# Altium schematic sheet io_conn.SchDoc: CPU I/O and USB Connectors
size B; Engineer: Michael J. Kelly; Organization: CSB540otn - Outernet; Address1: AM335x Compute Board; Address2: (C) 2015; Address3: See us on the Web:; Address4: http://outernet.is; DocumentNumber: 7; Revision: V1.0; SheetNumber: 7; SheetTotal: 9
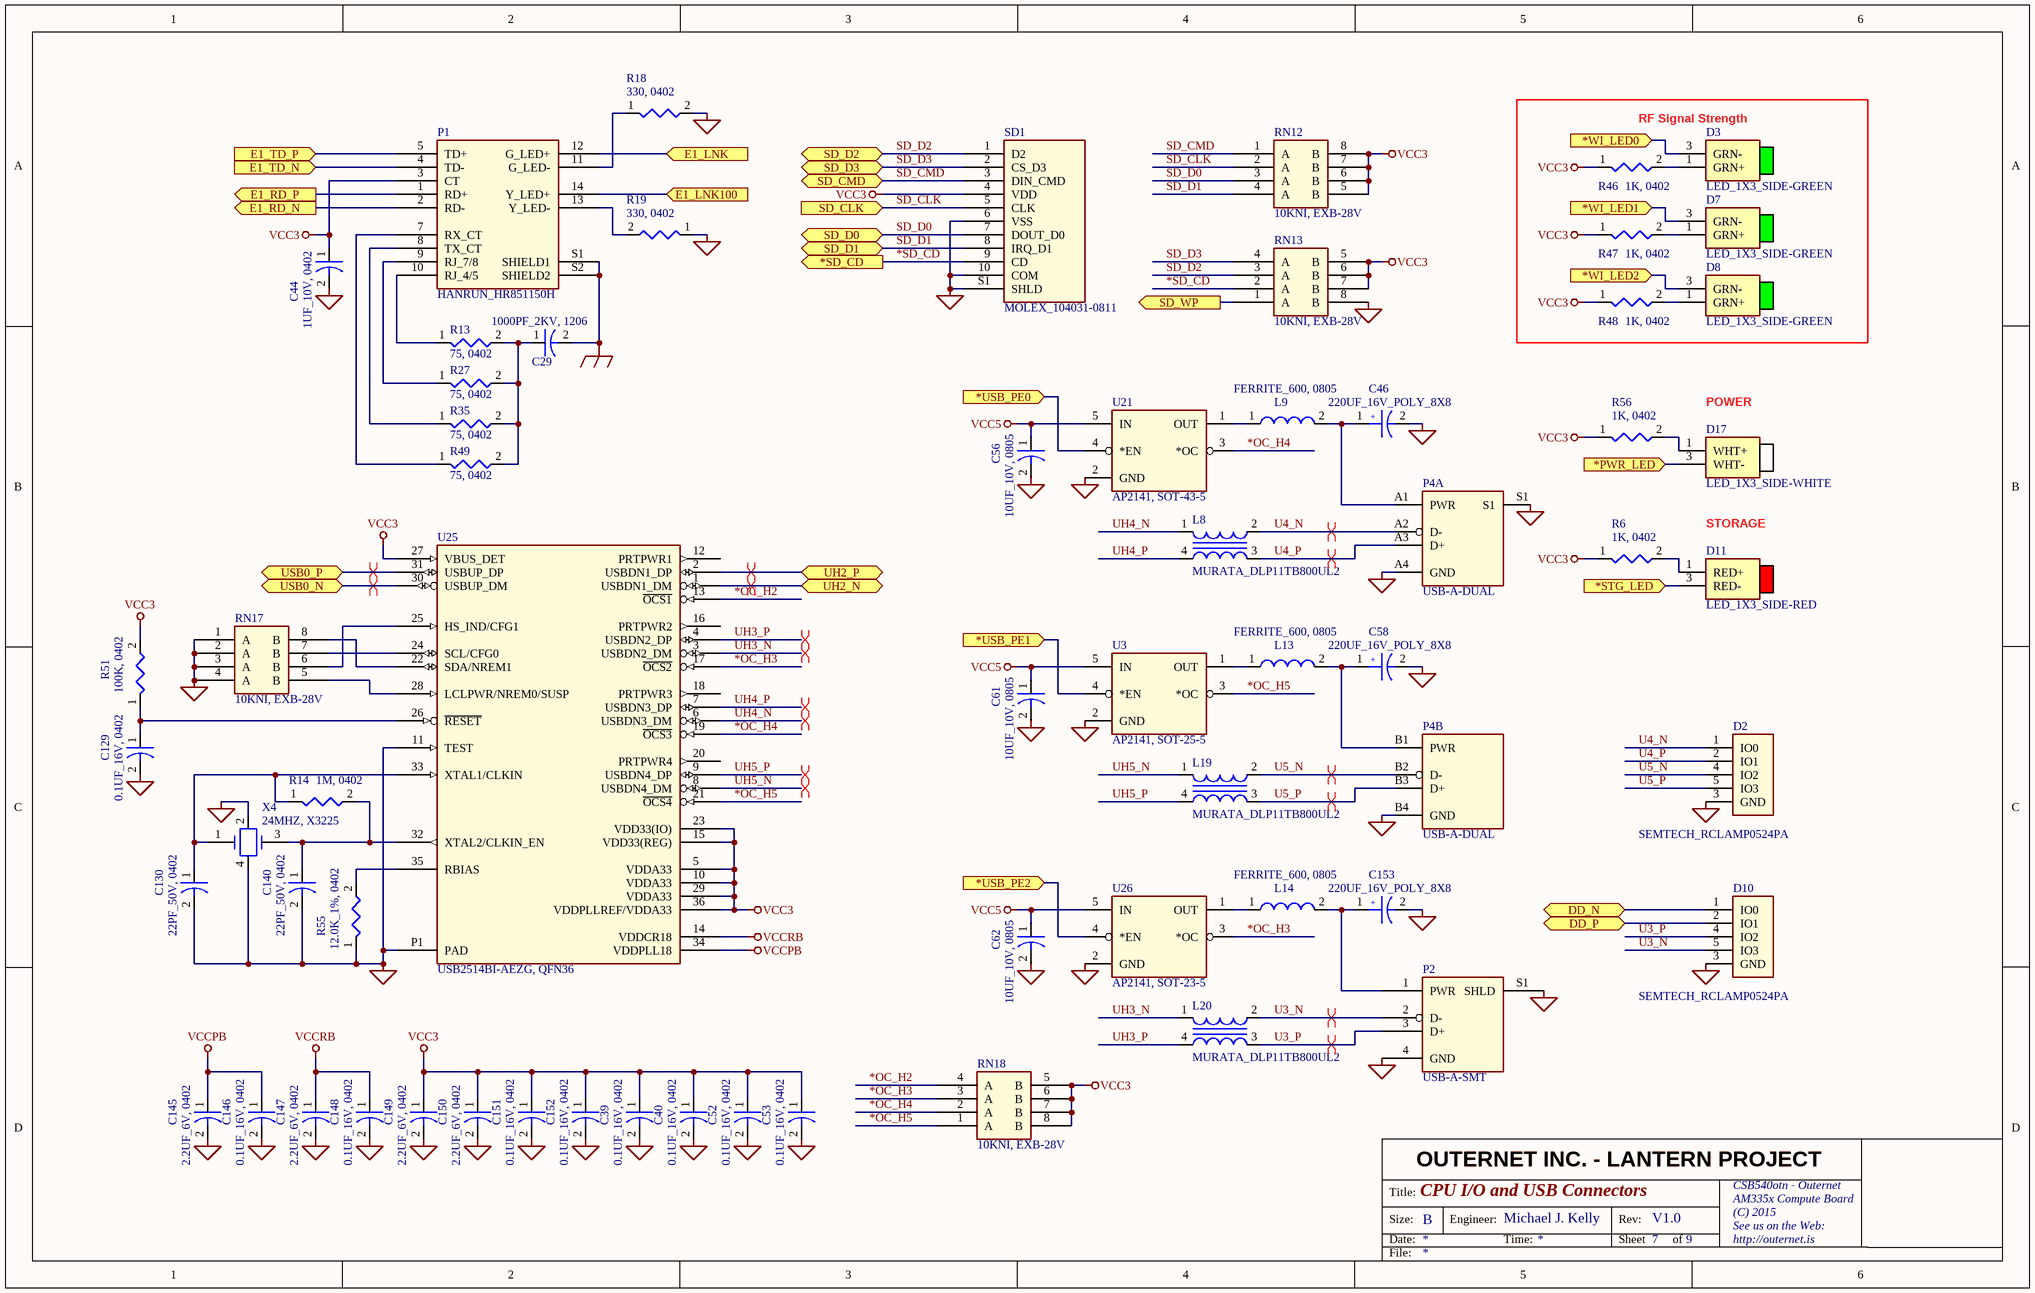
[diagram p0: io_conn.SchDoc]

## Parts
C29  1000PF_2KV, 1206  [1206C]
C39  0.1UF_16V, 0402  [0402C]
C40  0.1UF_16V, 0402  [0402C]
C44  1UF_10V, 0402  [0402C]
C46  220UF_16V_POLY_8X8  [ELEC_8MM_8MM]
C52  0.1UF_16V, 0402  [0402C]
C53  0.1UF_16V, 0402  [0402C]
C56  10UF_10V, 0805  [0805C]
C58  220UF_16V_POLY_8X8  [ELEC_8MM_8MM]
C61  10UF_10V, 0805  [0805C]
C62  10UF_10V, 0805  [0805C]
C129  0.1UF_16V, 0402  [0402C]
C130  22PF_50V, 0402  [0402C]
C140  22PF_50V, 0402  [0402C]
C145  2.2UF_6V, 0402  [0402C]
C146  0.1UF_16V, 0402  [0402C]
C147  2.2UF_6V, 0402  [0402C]
C148  0.1UF_16V, 0402  [0402C]
C149  2.2UF_6V, 0402  [0402C]
C150  2.2UF_6V, 0402  [0402C]
C151  0.1UF_16V, 0402  [0402C]
C152  0.1UF_16V, 0402  [0402C]
C153  220UF_16V_POLY_8X8  [ELEC_8MM_8MM]
D2  SEMTECH_RCLAMP0524PA  [RCLAMP0524]
D3  LED_1X3_SIDE-GREEN  [LED_1X3_SIDE-GREEN]
D7  LED_1X3_SIDE-GREEN  [LED_1X3_SIDE-GREEN]
D8  LED_1X3_SIDE-GREEN  [LED_1X3_SIDE-GREEN]
D10  SEMTECH_RCLAMP0524PA  [RCLAMP0524]
D11  LED_1X3_SIDE-RED  [LED_1X3_SIDE-RED]
D17  LED_1X3_SIDE-WHITE  [LED_1X3_SIDE-WHITE]
L8  MURATA_DLP11TB800UL2  [PANASONIC_EXC24C]
L9  FERRITE_600, 0805  [0805L]
L13  FERRITE_600, 0805  [0805L]
L14  FERRITE_600, 0805  [0805L]
L19  MURATA_DLP11TB800UL2  [PANASONIC_EXC24C]
L20  MURATA_DLP11TB800UL2  [PANASONIC_EXC24C]
P1  HANRUN_HR851150H  [SPEEDTECH_P65-101-1HQ9]
P2  USB-A-SMT  [USB-A-SMT]
P4  USB-A-DUAL  [USB-A-DUAL]  (parts A,B of 2)
R6  1K, 0402  [0402R]
R13  75, 0402  [0402R]
R14  1M, 0402  [0402R]
R18  330, 0402  [0402R]
R19  330, 0402  [0402R]
R27  75, 0402  [0402R]
R35  75, 0402  [0402R]
R46  1K, 0402  [0402R]
R47  1K, 0402  [0402R]
R48  1K, 0402  [0402R]
R49  75, 0402  [0402R]
R51  100K, 0402  [0402R]
R55  12.0K_1%, 0402  [0402R]
R56  1K, 0402  [0402R]
RN12  10KNI, EXB-28V  [EXB-28V]
RN13  10KNI, EXB-28V  [EXB-28V]
RN17  10KNI, EXB-28V  [EXB-28V]
RN18  10KNI, EXB-28V  [EXB-28V]
SD1  MOLEX_104031-0811  [MOLEX_104031-0811]
U3  AP2141, SOT-25-5  [SOT-23-5]
U21  AP2141, SOT-43-5  [SOT-23-5]
U25  USB2514BI-AEZG, QFN36  [QFN36]
U26  AP2141, SOT-23-5  [SOT-23-5]
X4  24MHZ, X3225  [X3225]

## Blocks framed on the sheet
RF Signal Strength: D3 D7 D8 R46-R48

## Ports
*PWR_LED (in), *SD_CD (out), *STG_LED (in), *USB_PE0 (in), *USB_PE1 (in), *USB_PE2 (in), *WI_LED0 (in), *WI_LED1 (in), *WI_LED2 (in), DD_N (bidir), DD_P (bidir), E1_LNK100 (in), E1_LNK (in), E1_RD_N (out), E1_RD_P (out), E1_TD_N (in), E1_TD_P (in), SD_CLK (in), SD_CMD (bidir), SD_D0 (bidir), SD_D1 (bidir), SD_D2 (bidir), SD_D3 (bidir), SD_WP (out), UH2_N (bidir), UH2_P (bidir), USB0_N (bidir), USB0_P (bidir)

## Nets
EARTH: C29.2 P1.S1(SHIELD1) P1.S2(SHIELD2)
GND: C39.2 C40.2 C44.2 C46.2 C52.2 C53.2 C56.2 C58.2 C61.2 C62.2 C129.2 C130.2 C140.2 C145.2 C146.2 C147.2 C148.2 C149.2 C150.2 C151.2 C152.2 C153.2 D2.3(GND) D10.3(GND) P2.4(GND) P2.S1(SHLD) P4.A4(GND) P4.B4(GND) P4.S1 R18.2 R19.1 R55.1 RN13.8(B) RN17.1(A) RN17.2(A) RN17.3(A) RN17.4(A) SD1.6(VSS) SD1.10(COM) SD1.S1(SHLD) U3.2(GND) U21.2(GND) U25.11(TEST) U25.P1(PAD) U26.2(GND) X4.2 X4.4
VCC3: C39.1 C40.1 C44.1 C52.1 C53.1 C149.1 C150.1 C151.1 C152.1 P1.3(CT) R6.1 R46.1 R47.1 R48.1 R51.2 R56.1 RN12.5(B) RN12.6(B) RN12.7(B) RN12.8(B) RN13.5(B) RN13.6(B) RN13.7(B) RN18.5(B) RN18.6(B) RN18.7(B) RN18.8(B) SD1.4(VDD) U25.5(VDDA33) U25.10(VDDA33) U25.15(VDD33(REG)) U25.23(VDD33(IO)) U25.27(VBUS_DET) U25.29(VDDA33) U25.36(VDDPLLREF/VDDA33)
VCC5: C56.1 C61.1 C62.1 U3.5(IN) U21.5(IN) U26.5(IN)
VCCPB: C145.1 C146.1 U25.34(VDDPLL18)
VCCRB: C147.1 C148.1 U25.14(VDDCR18)
*OC_H2: RN18.4(A) U25.13(~{OCS1})
*OC_H3: RN18.3(A) U25.17(~{OCS2}) U26.3(*OC)
*OC_H4: RN18.2(A) U21.3(*OC) U25.19(~{OCS3})
*OC_H5: RN18.1(A) U3.3(*OC) U25.21(~{OCS4})
*PWR_LED: D17.3(WHT-) ; port *PWR_LED
*SD_CD: RN13.2(A) SD1.9(CD) ; port *SD_CD
*STG_LED: D11.3(RED-) ; port *STG_LED
*USB_PE0: U21.4(*EN) ; port *USB_PE0
*USB_PE1: U3.4(*EN) ; port *USB_PE1
*USB_PE2: U26.4(*EN) ; port *USB_PE2
*WI_LED0: D3.3(GRN-) ; port *WI_LED0
*WI_LED1: D7.3(GRN-) ; port *WI_LED1
*WI_LED2: D8.3(GRN-) ; port *WI_LED2
DD_N: D10.1(IO0) ; port DD_N
DD_P: D10.2(IO1) ; port DD_P
E1_LNK: P1.12(G_LED+) ; port E1_LNK
E1_LNK100: P1.14(Y_LED+) ; port E1_LNK100
E1_RD_N: P1.2(RD-) ; port E1_RD_N
E1_RD_P: P1.1(RD+) ; port E1_RD_P
E1_TD_N: P1.4(TD-) ; port E1_TD_N
E1_TD_P: P1.5(TD+) ; port E1_TD_P
SD_CLK: RN12.2(A) SD1.5(CLK) ; port SD_CLK
SD_CMD: RN12.1(A) SD1.3(DIN_CMD) ; port SD_CMD
SD_D0: RN12.3(A) SD1.7(DOUT_D0) ; port SD_D0
SD_D1: RN12.4(A) SD1.8(IRQ_D1) ; port SD_D1
SD_D2: RN13.3(A) SD1.1(D2) ; port SD_D2
SD_D3: RN13.4(A) SD1.2(CS_D3) ; port SD_D3
SD_WP: RN13.1(A) ; port SD_WP
U3_N: D10.5(IO3) L20.2 P2.2(D-)
U3_P: D10.4(IO2) L20.3 P2.3(D+)
U4_N: D2.1(IO0) L8.2 P4.A2(D-)
U4_P: D2.2(IO1) L8.3 P4.A3(D+)
U5_N: D2.4(IO2) L19.2 P4.B2(D-)
U5_P: D2.5(IO3) L19.3 P4.B3(D+)
UH2_N: U25.1(USBDN1_DM) ; port UH2_N
UH2_P: U25.2(USBDN1_DP) ; port UH2_P
UH3_N: L20.1 U25.3(USBDN2_DM)
UH3_P: L20.4 U25.4(USBDN2_DP)
UH4_N: L8.1 U25.6(USBDN3_DM)
UH4_P: L8.4 U25.7(USBDN3_DP)
UH5_N: L19.1 U25.8(USBDN4_DM)
UH5_P: L19.4 U25.9(USBDN4_DP)
USB0_N: U25.30(USBUP_DM) ; port USB0_N
USB0_P: U25.31(USBUP_DP) ; port USB0_P
NetC29_1: C29.1 R13.2 R27.2 R35.2 R49.2
NetC46_1: C46.1 L9.2 P4.A1(PWR)
NetC58_1: C58.1 L13.2 P4.B1(PWR)
NetC129_1: C129.1 R51.1 U25.26(~{RESET})
NetC130_1: C130.1 R14.1 U25.33(XTAL1/CLKIN) X4.1
NetC140_1: C140.1 R14.2 U25.32(XTAL2/CLKIN_EN) X4.3
NetC153_1: C153.1 L14.2 P2.1(PWR)
NetD3_1: D3.1(GRN+) R46.2
NetD7_1: D7.1(GRN+) R47.2
NetD8_1: D8.1(GRN+) R48.2
NetD11_1: D11.1(RED+) R6.2
NetD17_1: D17.1(WHT+) R56.2
NetL9_1: L9.1 U21.1(OUT)
NetL13_1: L13.1 U3.1(OUT)
NetL14_1: L14.1 U26.1(OUT)
NetP1_7: P1.7(RX_CT) R49.1
NetP1_8: P1.8(TX_CT) R35.1
NetP1_9: P1.9(RJ_7/8) R27.1
NetP1_10: P1.10(RJ_4/5) R13.1
NetP1_11: P1.11(G_LED-) R18.1
NetP1_13: P1.13(Y_LED-) R19.2
NetR55_2: R55.2 U25.35(RBIAS)
NetRN17_5: RN17.5(B) U25.28(LCLPWR/NREM0/SUSP)
NetRN17_6: RN17.6(B) U25.25(HS_IND/CFG1)
NetRN17_7: RN17.7(B) U25.24(SCL/CFG0)
NetRN17_8: RN17.8(B) U25.22(SDA/NREM1)

Not connected (* = marked no-connect by the designer): U25 12(PRTPWR1) 16(PRTPWR2) 18(PRTPWR3) 20(PRTPWR4)

## Layout directives
differential pair: U3_N, U3_P, U4_N, U4_P, U5_N, U5_P, UH2_N, UH2_P, UH3_N, UH3_P, UH4_N, UH4_P, UH5_N, UH5_P, USB0_N, USB0_P

## Notes on the sheet
- POWER
- STORAGE
- OUTERNET INC. - LANTERN PROJECT
- Title:
- Size:
- Date:
- B
- Engineer:
- Time:
- Rev:
- Sheet
- of
- File:
- (in symbol 220UF_16V_POLY_8X8) +

## Library data of the parts
C29 = 1000PF_2KV, 1206: CAP - 1206 PKG
C39 C40 C52 C53 C129 C146 C148 C151 C152 = 0.1UF_16V, 0402: CAP - 0402 PKG
C44 = 1UF_10V, 0402: CAP - 0402 PKG
C46 C58 C153 = 220UF_16V_POLY_8X8: CAP - ELEC_POLY, 8mm x 8mm x 3.5mm
C56 C61 C62 = 10UF_10V, 0805: CAP - 0805 PKG
C130 C140 = 22PF_50V, 0402: CAP - 0402 PKG
C145 C147 C149 C150 = 2.2UF_6V, 0402: CAP - 0402 PKG
D2 D10 = SEMTECH_RCLAMP0524PA: DIODE - TVS ARRAY, 0.3PF
D3 D7 D8 = LED_1X3_SIDE-GREEN: LED - SIDEVIEW, SMT, GREEN
D11 = LED_1X3_SIDE-RED: LED - SIDEVIEW, SMT, RED
D17 = LED_1X3_SIDE-WHITE: LED - SIDEVIEW, SMT, WHITE
L8 L19 L20 = MURATA_DLP11TB800UL2: FERRITE - COMMON MODE FILTER, USB3, FILM
L9 L13 L14 = FERRITE_600, 0805: FERRITE BEAD - 600 OHM, 2A, 0805 PKG
P1 = HANRUN_HR851150H: CONN - RJ45 10/100 W/POE, SPEEDTECH
P2 = USB-A-SMT: CONN - USB TYPE A SMT
P4 = USB-A-DUAL: CONN - USB TYPE A - DUAL
R6 R46-R48 R56 = 1K, 0402: RES - 0402 PKG
R13 R27 R35 R49 = 75, 0402: RES - 0402 PKG
R14 = 1M, 0402: RES - 0402 PKG
R18 R19 = 330, 0402: RES - 0402 PKG
R51 = 100K, 0402: RES - 0402 PKG
R55 = 12.0K_1%, 0402: RES - 0402 PKG
RN12 RN13 RN17 RN18 = 10KNI, EXB-28V: RES NET, 4 INDIVIDUAL, EXB-28V
SD1 = MOLEX_104031-0811: CONN - SD/MMC, MICRO, PUSH/PUSH, W/CD
U3 U21 U26 = AP2141, SOT-23-5: IC - POWER SWITCH, 500MA, LOW TRUE
U25 = USB2514BI-AEZG, QFN36: USB - 2.0 HUB, FOUR PORT, I-TEMP
X4 = 24MHZ, X3225: CRYSTAL - SMT, 3.2MM x 2.5MM, ABM8 PKG